# EAGLE schematic relay-set-d-latch (EAGLE 7.7.0)
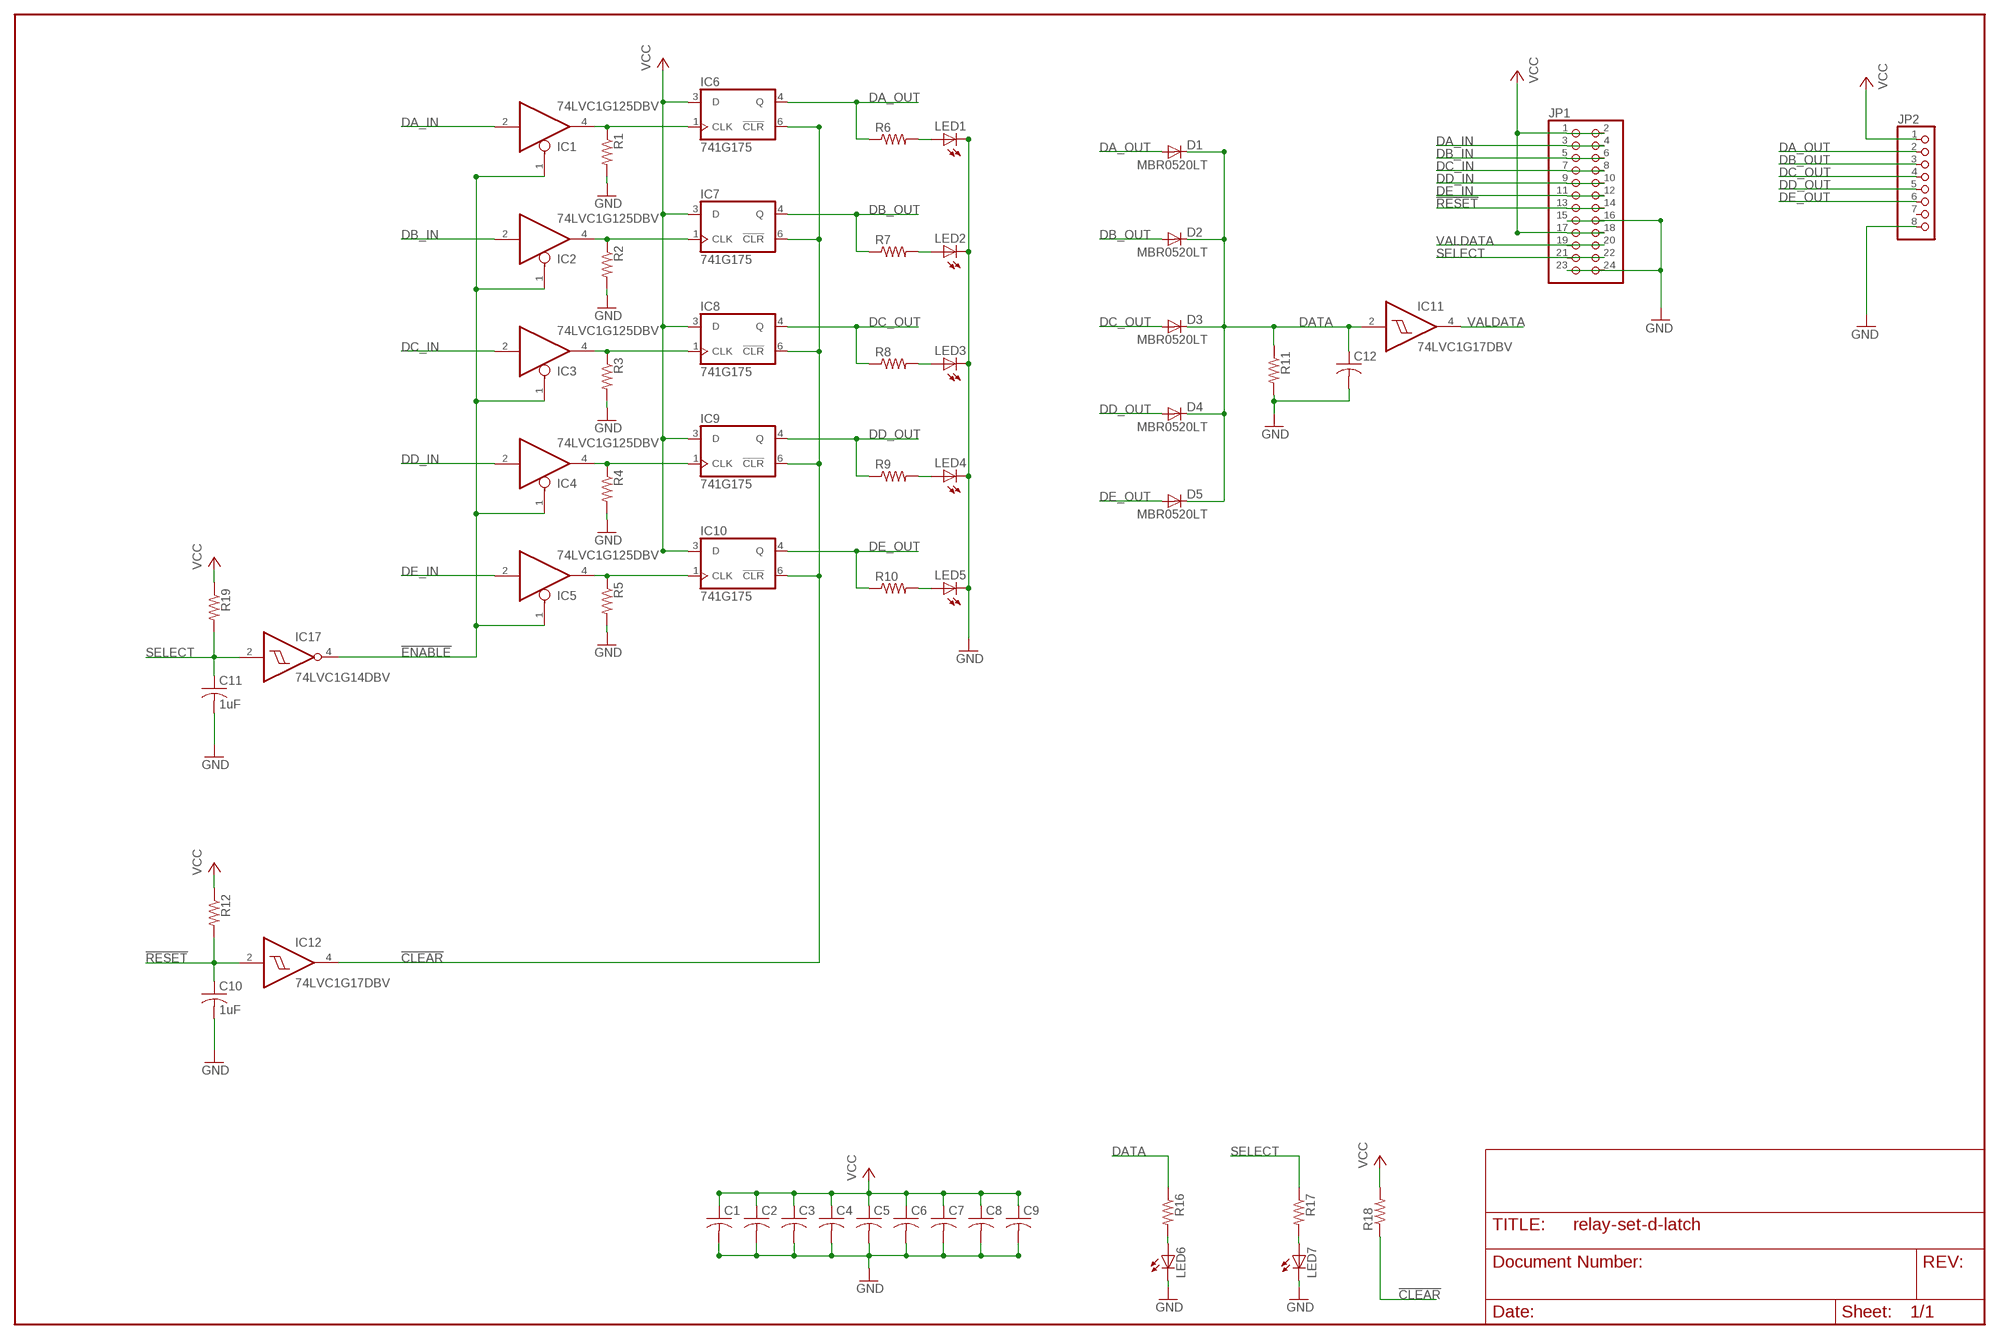
[diagram p0: schematic, sheet 1]

## Parts
C1  C-USC0805  [C0805]
C2  C-USC0805  [C0805]
C3  C-USC0805  [C0805]
C4  C-USC0805  [C0805]
C5  C-USC0603K  [C0603K]
C6  C-USC0603K  [C0603K]
C7  C-USC0603K  [C0603K]
C8  C-USC0603K  [C0603K]
C9  C-USC0603K  [C0603K]
C10  1uF  C-USC0603K  [C0603K]
C11  1uF  C-USC0603K  [C0603K]
C12  C-USC0805  [C0805]
D1  MBR0520LT  [SOD123]
D2  MBR0520LT  [SOD123]
D3  MBR0520LT  [SOD123]
D4  MBR0520LT  [SOD123]
D5  MBR0520LT  [SOD123]
IC1  74LVC1G125DBV  [SOT23-5]
IC2  74LVC1G125DBV  [SOT23-5]
IC3  74LVC1G125DBV  [SOT23-5]
IC4  74LVC1G125DBV  [SOT23-5]
IC5  74LVC1G125DBV  [SOT23-5]
IC6  741G175  [DBV_R-PDSO-G6]
IC7  741G175  [DBV_R-PDSO-G6]
IC8  741G175  [DBV_R-PDSO-G6]
IC9  741G175  [DBV_R-PDSO-G6]
IC10  741G175  [DBV_R-PDSO-G6]
IC11  74LVC1G17DBV  [SOT23-5]
IC12  74LVC1G17DBV  [SOT23-5]
IC17  74LVC1G14DBV  [SOT23-5]
JP1  PINHD-2X12  [2X12]
JP2  PINHD-1X8  [1X08]
LED1  LEDCHIP-LED0805  [CHIP-LED0805]
LED2  LEDCHIP-LED0805  [CHIP-LED0805]
LED3  LEDCHIP-LED0805  [CHIP-LED0805]
LED4  LEDCHIP-LED0805  [CHIP-LED0805]
LED5  LEDCHIP-LED0805  [CHIP-LED0805]
LED6  LEDCHIP-LED0805  [CHIP-LED0805]
LED7  LEDCHIP-LED0805  [CHIP-LED0805]
R1  R-US_R0805  [R0805]
R2  R-US_R0805  [R0805]
R3  R-US_R0805  [R0805]
R4  R-US_R0805  [R0805]
R5  R-US_R0805  [R0805]
R6  R-US_R0805  [R0805]
R7  R-US_R0805  [R0805]
R8  R-US_R0805  [R0805]
R9  R-US_R0805  [R0805]
R10  R-US_R0805  [R0805]
R11  R-US_R0805  [R0805]
R12  R-US_R0805  [R0805]
R16  R-US_R0805  [R0805]
R17  R-US_R0805  [R0805]
R18  R-US_R0805  [R0805]
R19  R-US_R0805  [R0805]

## Nets
!CLEAR: IC6.6(!CLR) IC7.6(!CLR) IC8.6(!CLR) IC9.6(!CLR) IC10.6(!CLR) IC12.4(O) R18.1
!ENABLE: IC1.1(OE) IC2.1(OE) IC3.1(OE) IC4.1(OE) IC5.1(OE) IC17.4(O)
!RESET: C10.1 IC12.2(I) JP1.13 JP1.14 R12.2
DA: IC1.4(O) IC6.1(CLK) R1.1
DA_IN: IC1.2(I) JP1.3 JP1.4
DA_OUT: D1.A IC6.4(Q) JP2.2 R6.1
DATA: C12.1 D1.C D2.C D3.C D4.C D5.C IC11.2(I) R11.1 R16.1
DB: IC2.4(O) IC7.1(CLK) R2.1
DB_IN: IC2.2(I) JP1.5 JP1.6
DB_OUT: D2.A IC7.4(Q) JP2.3 R7.1
DC: IC3.4(O) IC8.1(CLK) R3.1
DC_IN: IC3.2(I) JP1.7 JP1.8
DC_OUT: D3.A IC8.4(Q) JP2.4 R8.1
DD: IC4.4(O) IC9.1(CLK) R4.1
DD_IN: IC4.2(I) JP1.9 JP1.10
DD_OUT: D4.A IC9.4(Q) JP2.5 R9.1
DE: IC5.4(O) IC10.1(CLK) R5.1
DE_IN: IC5.2(I) JP1.11 JP1.12
DE_OUT: D5.A IC10.4(Q) JP2.6 R10.1
GND: C1.2 C2.2 C3.2 C4.2 C5.2 C6.2 C7.2 C8.2 C9.2 C10.2 C11.2 C12.2 JP1.15 JP1.16 JP1.23 JP1.24 JP2.8 LED1.C LED2.C LED3.C LED4.C LED5.C LED6.C LED7.C R1.2 R2.2 R3.2 R4.2 R5.2 R11.2
N$20: LED1.A R6.2
N$21: LED2.A R7.2
N$22: LED3.A R8.2
N$24: LED7.A R17.2
N$27: LED6.A R16.2
N$28: LED4.A R9.2
N$29: LED5.A R10.2
SELECT: C11.1 IC17.2(I) JP1.21 JP1.22 R17.1 R19.2
VALDATA: IC11.4(O) JP1.19 JP1.20
VCC: C1.1 C2.1 C3.1 C4.1 C5.1 C6.1 C7.1 C8.1 C9.1 IC6.3(D) IC7.3(D) IC8.3(D) IC9.3(D) IC10.3(D) JP1.1 JP1.2 JP1.17 JP1.18 JP2.1 R12.1 R18.2 R19.1
Unconnected: JP2.7

## Power pins joined to a net without a drawn wire
GND: IC1.3(GND) IC2.3(GND) IC3.3(GND) IC4.3(GND) IC5.3(GND) IC6.2(GND) IC7.2(GND) IC8.2(GND) IC9.2(GND) IC10.2(GND) IC11.3(GND) IC12.3(GND) IC17.3(GND)
VCC: IC1.5(VCC) IC2.5(VCC) IC3.5(VCC) IC4.5(VCC) IC5.5(VCC) IC6.5(VCC) IC7.5(VCC) IC8.5(VCC) IC9.5(VCC) IC10.5(VCC) IC11.5(VCC) IC12.5(VCC) IC17.5(VCC)

## Library data of the parts
C1-C12 = resistor:C-US: CAPACITOR, American symbol
D1-D5 = diode:MBR0520LT: SCHOTTKY BARRIER RECTIFIER Source: http://onsemi.com .. MBR0520LT1-D.pdf
IC1-IC5 = 74xx-little-us:74*1G125: Single Bus Buffer Gate with 3-State Output
IC6-IC10 = 74xx-little-us:74*1G175
IC11 IC12 = 74xx-little-us:74*1G17: Single Schmitt-Trigger Buffer
IC17 = 74xx-little-us:74*1G14: Single Schmitt-Trigger Inverter Gate
JP1 = custom-pinhead:PINHD-2X12: PIN HEADER
JP2 = pinhead:PINHD-1X8: PIN HEADER
LED1-LED7 = led:LED: LED OSRAM: - CHIPLED LG R971, LG N971, LY N971, LG Q971, LY Q971, LO R971, LY R971 LH N974, LH R974 LS Q976, LO Q976, LY Q976 LO Q996 - Hyper CHIPLED LW Q18S LB Q993, LB Q99A, LB R99A - SideLED LS A670, LO A670, LY A670, LG A670, LP A670 LB A673, LV A673, LT A673, LW A673 LH A674 LY A675 LS A676, LA A676, LO A676, LY A676, LW A676 LS A679, LY A679, LG A679 - Hyper Micro SIDELED® LS Y876, LA Y876, LO Y876, LY Y876 LT Y87S - SmartLED LW L88C, LW L88S LB L89C, LB L89S, LG L890 LS L89K, LO L89K, LY L89K LS L896, LA L896, LO L896, LY L896 - TOPLED LS T670, LO T670, LY T670, LG T670, LP T670 LSG T670, LSP T670, LSY T670, LOP T670, LYG T670 LG T671, LOG T671, LSG T671 LB T673, LV T673, LT T673, LW T673 LH T674 LS T676, LA T676, LO T676, LY T676, LB T676, LH T676, LSB T676, LW T676 LB T67C, LV T67C, LT T67C, LS T67K, LO T67K, LY T67K, LW E67C LS E67B, LA E67B, LO E67B, LY E67B, LB E67C, LV E67C, LT E67C LW T67C LS T679, LY T679, LG T679 LS T770, LO T770, LY T770, LG T770, LP T770 LB T773, LV T773, LT T773, LW T773 LH T774 LS E675, LA E675, LY E675, LS T675 LS T776, LA T776, LO T776, LY T776, LB T776 LHGB T686 LT T68C, LB T68C - Hyper Mini TOPLED® LB M676 - Mini TOPLED Santana® LG M470 LS M47K, LO M47K, LY M47K Source: http://www.osram.convergy.de LUXEON: - LUMILED® LXK2-PW12-R00, LXK2-PW12-S00, LXK2-PW14-U00, LXK2-PW14-V00 LXK2-PM12-R00, LXK2-PM12-S00, LXK2-PM14-U00 LXK2-PE12-Q00, LXK2-PE12-R00, LXK2-PE12-S00, LXK2-PE14-T00, LXK2-PE14-U00 LXK2-PB12-K00, LXK2-PB12-L00, LXK2-PB12-M00, LXK2-PB14-N00, LXK2-PB14-P00, LXK2-PB14-Q00 LXK2-PR12-L00, LXK2-PR12-M00, LXK2-PR14-Q00, LXK2-PR14-R00 LXK2-PD12-Q00, LXK2-PD12-R00, LXK2-PD12-S00 LXK2-PH12-R00, LXK2-PH12-S00 LXK2-PL12-P00, LXK2-PL12-Q00, LXK2-PL12-R00 Source: www.luxeon.com KINGBRIGHT: KA-3528ASYC Source: www.kingbright.com
R1-R12 R16-R19 = resistor:R-US_: RESISTOR, American symbol